# EAGLE design leds (EAGLE 9.6.2)
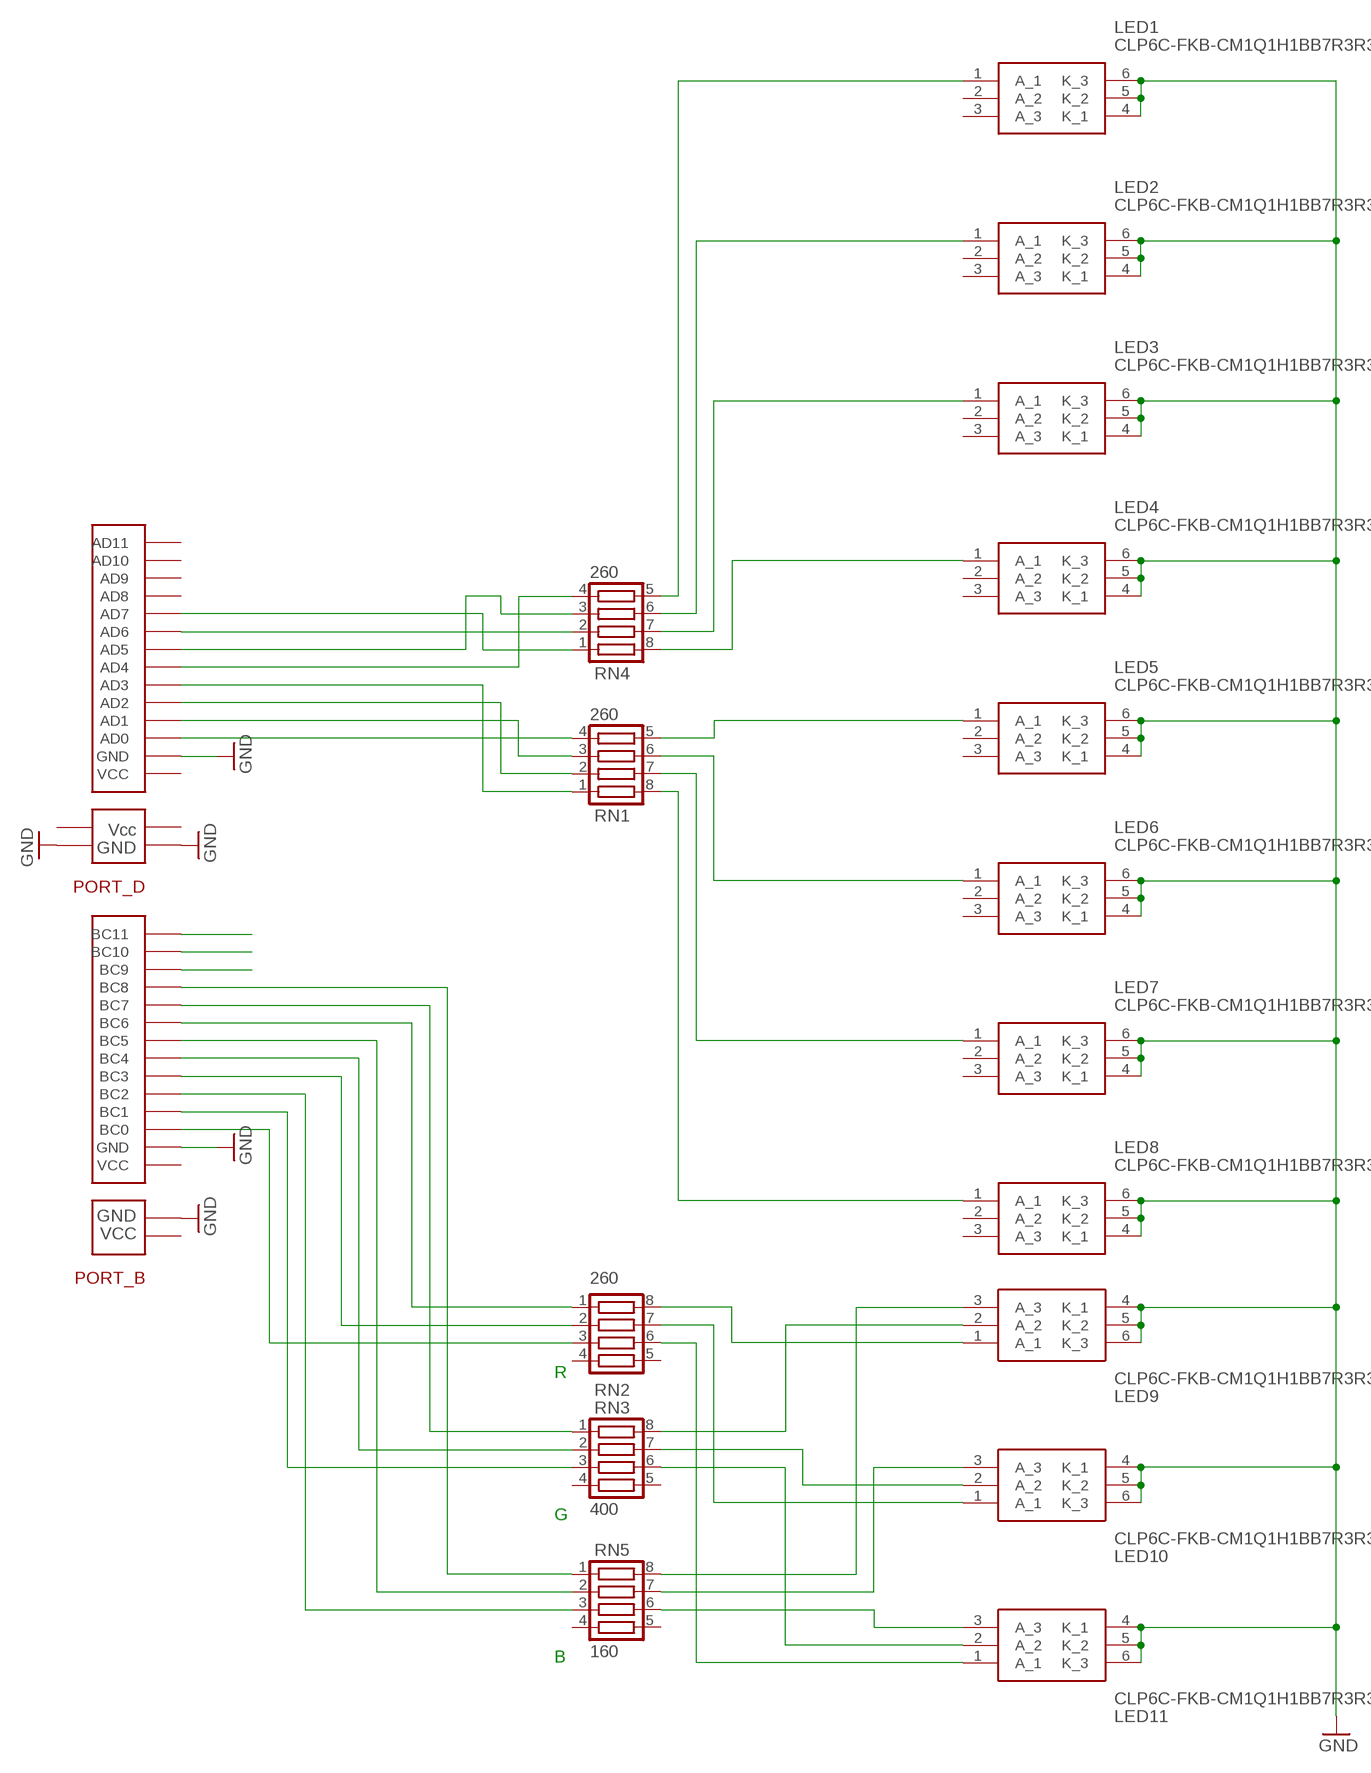
[diagram p0: schematic, sheet 1]

## Parts
LED1  CLP6C-FKB-CM1Q1H1BB7R3R3  [CLP6CFKBCM1Q1H1BB7R3R3]
LED2  CLP6C-FKB-CM1Q1H1BB7R3R3  [CLP6CFKBCM1Q1H1BB7R3R3]
LED3  CLP6C-FKB-CM1Q1H1BB7R3R3  [CLP6CFKBCM1Q1H1BB7R3R3]
LED4  CLP6C-FKB-CM1Q1H1BB7R3R3  [CLP6CFKBCM1Q1H1BB7R3R3]
LED5  CLP6C-FKB-CM1Q1H1BB7R3R3  [CLP6CFKBCM1Q1H1BB7R3R3]
LED6  CLP6C-FKB-CM1Q1H1BB7R3R3  [CLP6CFKBCM1Q1H1BB7R3R3]
LED7  CLP6C-FKB-CM1Q1H1BB7R3R3  [CLP6CFKBCM1Q1H1BB7R3R3]
LED8  CLP6C-FKB-CM1Q1H1BB7R3R3  [CLP6CFKBCM1Q1H1BB7R3R3]
LED9  CLP6C-FKB-CM1Q1H1BB7R3R3  [CLP6CFKBCM1Q1H1BB7R3R3]
LED10  CLP6C-FKB-CM1Q1H1BB7R3R3  [CLP6CFKBCM1Q1H1BB7R3R3]
LED11  CLP6C-FKB-CM1Q1H1BB7R3R3  [CLP6CFKBCM1Q1H1BB7R3R3]
PORT_B  PATICE_CERVENA  [PATICE_CERVENA]
PORT_D  PATICE_ZELENA  [PATICE_ZELENA]
RN1  260  CTS742C083  [CTS742C083]
RN2  260  CTS742C083  [CTS742C083]
RN3  400  CTS742C083  [CTS742C083]
RN4  260  CTS742C083  [CTS742C083]
RN5  160  CTS742C083  [CTS742C083]

## Nets
GND: LED1.4(K_1) LED1.5(K_2) LED1.6(K_3) LED2.4(K_1) LED2.5(K_2) LED2.6(K_3) LED3.4(K_1) LED3.5(K_2) LED3.6(K_3) LED4.4(K_1) LED4.5(K_2) LED4.6(K_3) LED5.4(K_1) LED5.5(K_2) LED5.6(K_3) LED6.4(K_1) LED6.5(K_2) LED6.6(K_3) LED7.4(K_1) LED7.5(K_2) LED7.6(K_3) LED8.4(K_1) LED8.5(K_2) LED8.6(K_3) LED9.4(K_1) LED9.5(K_2) LED9.6(K_3) LED10.4(K_1) LED10.5(K_2) LED10.6(K_3) LED11.4(K_1) LED11.5(K_2) LED11.6(K_3) PORT_B.GND PORT_B.GND/(GND) PORT_D.GND PORT_D.GND/(GND) PORT_D.GND//(GND)
N$1: LED1.1(A_1) RN4.5
N$2: LED2.1(A_1) RN4.6
N$3: LED3.1(A_1) RN4.7
N$4: LED4.1(A_1) RN4.8
N$5: PORT_B.CB3(BC3) RN2.2
N$6: PORT_B.CB0(BC0) RN2.3
N$7: LED7.1(A_1) RN1.7
N$8: LED9.2(A_2) RN3.8
N$9: LED8.1(A_1) RN1.8
N$10: PORT_D.AD0 RN1.4
N$12: PORT_B.CB6(BC6) RN2.1
N$13: PORT_B.CB9(BC9)
N$14: PORT_B.CB10(BC10)
N$15: PORT_B.CB11(BC11)
N$16: PORT_D.AD1 RN1.3
N$18: PORT_B.CB2(BC2) RN5.3
N$19: PORT_D.AD2 RN1.2
N$20: PORT_D.AD3 RN1.1
N$21: PORT_D.AD7 RN4.1
N$22: PORT_D.AD6 RN4.2
N$23: PORT_D.AD5 RN4.3
N$24: PORT_D.AD4 RN4.4
N$25: LED5.1(A_1) RN1.5
N$26: PORT_B.CB1(BC1) RN3.3
N$30: PORT_B.CB7(BC7) RN3.1
N$31: LED6.1(A_1) RN1.6
N$33: PORT_B.CB8(BC8) RN5.1
N$34: PORT_B.CB5(BC5) RN5.2
N$35: PORT_B.CB4(BC4) RN3.2
N$36: LED9.3(A_3) RN5.8
N$37: LED10.3(A_3) RN5.7
N$38: LED11.3(A_3) RN5.6
N$40: LED9.1(A_1) RN2.8
N$41: LED10.1(A_1) RN2.7
N$42: LED11.1(A_1) RN2.6
N$43: LED11.2(A_2) RN3.6
N$45: LED10.2(A_2) RN3.7
Unconnected: LED1.2(A_2) LED1.3(A_3) LED2.2(A_2) LED2.3(A_3) LED3.2(A_2) LED3.3(A_3) LED4.2(A_2) LED4.3(A_3) LED5.2(A_2) LED5.3(A_3) LED6.2(A_2) LED6.3(A_3) LED7.2(A_2) LED7.3(A_3) LED8.2(A_2) LED8.3(A_3) PORT_B.VCC PORT_B.VCC/(VCC) PORT_D.AD8 PORT_D.AD9 PORT_D.AD10 PORT_D.AD11 PORT_D.VCC PORT_D.VCC/(VCC) PORT_D.VCC//(VCC) RN2.4 RN2.5 RN3.4 RN3.5 RN5.4 RN5.5

## Notes on the sheet
- R
- G
- B

## Library data of the parts
LED1-LED11 = CLP6C-FKB-CM1Q1H1BB7R3R3:CLP6C-FKB-CM1Q1H1BB7R3R3: Cree,LED,CLP6C-FKB-CM1Q1H1BB7R3R3 Cree CLP6C-FKB-CM1Q1H1BB7R3R3, CLP6 Series Green LED, 540 nm, PLCC 6, Round Lens SMD Package Source: Datasheet <http://docs-emea.rs-online.com/webdocs/0cdd/0900766b80cddec4.pdf>; DESCRIPTION: Cree,LED,CLP6C-FKB-CM1Q1H1BB7R3R3 Cree CLP6C-FKB-CM1Q1H1BB7R3R3, CLP6 Series Green LED, 540 nm, PLCC 6, Round Lens SMD Package; HEIGHT: 2.6mm; MANUFACTURER_NAME: Cree, Inc.; MANUFACTURER_PART_NUMBER: CLP6C-FKB-CM1Q1H1BB7R3R3; MOUSER_PART_NUMBER: 941-P6CFKBCM1Q1H17R3; MOUSER_PRICE-STOCK: https://www.mouser.com/Search/Refine.aspx?Keyword=941-P6CFKBCM1Q1H17R3; RS_PART_NUMBER: 8106939P; RS_PRICE-STOCK: http://uk.rs-online.com/web/p/products/8106939P
PORT_B = patice_kit:PATICE_CERVENA
PORT_D = patice_kit:PATICE_ZELENA
RN1 RN2 RN4 = resistor-net:CTS742C083: Chip Resistor Array 4 Single Resistor Source: http://www.ctscorp.com/components/Datasheets/CTSChipArrayDs.pdf; FARNELL: 2908182; OC_FARNELL: unknown; OC_NEWARK: unknown
RN3 = resistor-net:CTS742C083: Chip Resistor Array 4 Single Resistor Source: http://www.ctscorp.com/components/Datasheets/CTSChipArrayDs.pdf; FARNELL: 2787792; OC_FARNELL: unknown; OC_NEWARK: unknown
RN5 = resistor-net:CTS742C083: Chip Resistor Array 4 Single Resistor Source: http://www.ctscorp.com/components/Datasheets/CTSChipArrayDs.pdf; FARNELL: 2321721; OC_FARNELL: unknown; OC_NEWARK: unknown

## Board
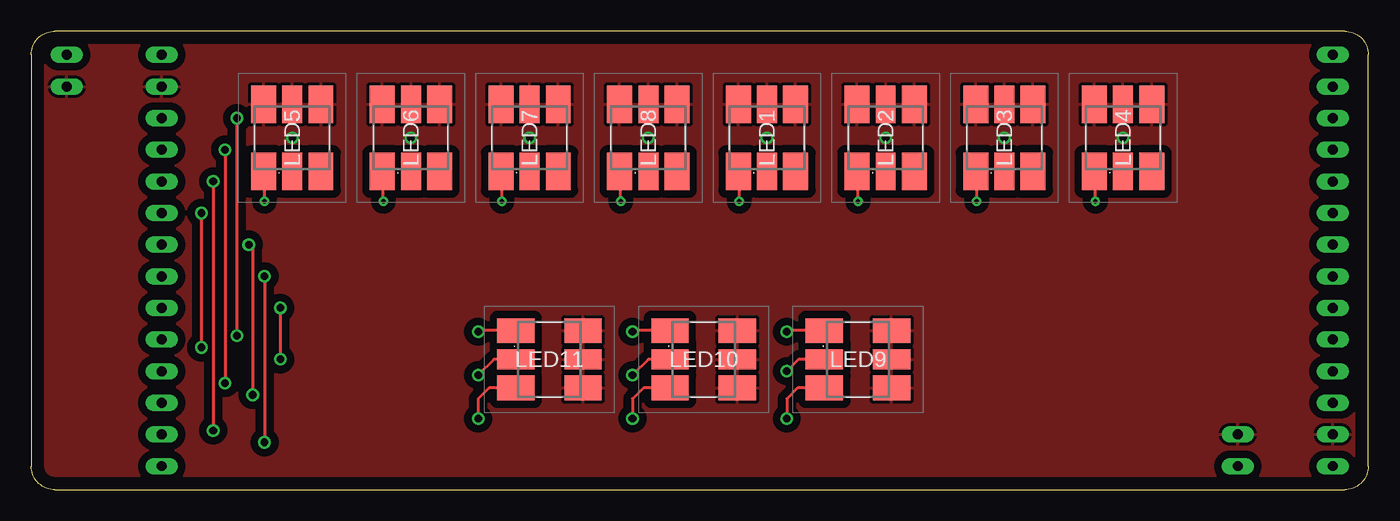
[diagram p1: board, top side]
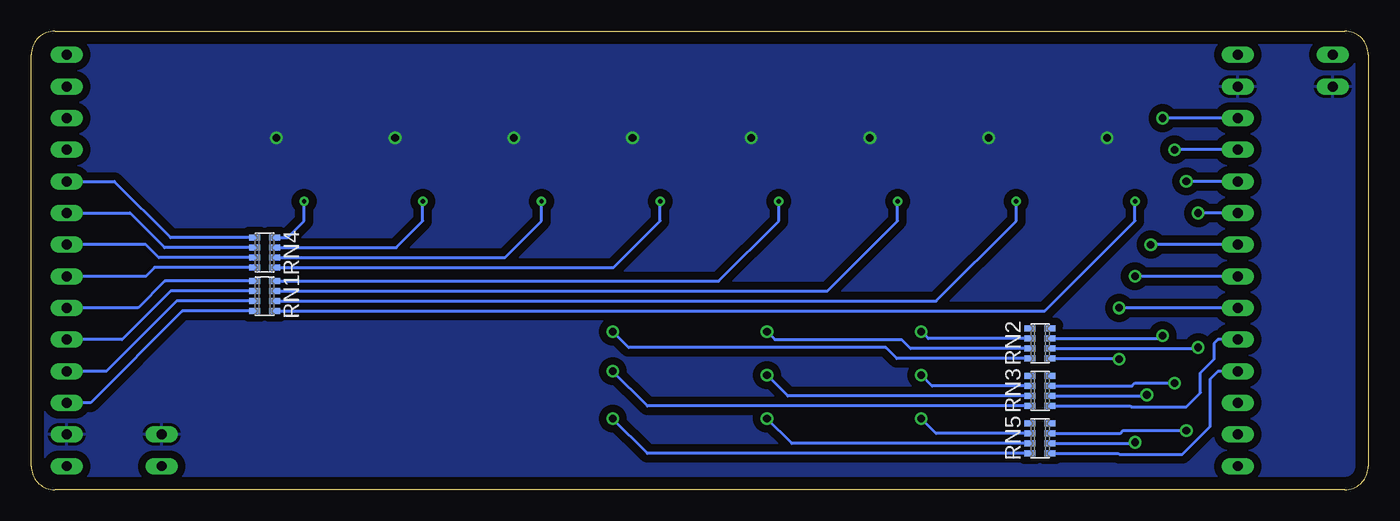
[diagram p2: board, bottom side, seen from below]

Size 107.31 x 36.83 mm. Coordinates in mm from the lower left corner, seen from the top.
Outline: 1.9,0 105.41,0 arc90 107.31,1.91 107.31,34.92 arc90 105.41,36.83 1.9,36.83 arc90 0,34.92 0,1.91 arc90 1.9,0
Copper layers (1*16): Top 0.035mm / dielectric 1.5mm / Bottom 0.035mm
Design rules "default": minimum track width 10mil, minimum drill 24mil, track to track 8mil, track to pad 8mil, pad to pad 8mil, via to via 8mil, smd to smd 8mil, copper to edge 40mil, drill to drill 8mil, minimum pad ring 10mil, minimum via ring 8mil, stop-mask expansion 4mil, vias tented up to drill 0mil, thermal gap 10mil

### Footprints (pad centres in the part's own frame; a part is rotated, then mirrored left to right if it is on the bottom)
CLP6CFKBCM1Q1H1BB7R3R3 = smd 3 x 2: 1 -2.7,2.3; 3 -2.7,-2.3; 4 2.7,-2.3; 6 2.7,2.3 | smd 3 x 1.6: 2 -2.7,0; 5 2.7,0
PATICE_CERVENA = drill 0.8 long: CB0 0,-5.08; CB1 0,-7.62; CB2 0,-10.16; CB3 0,-12.7; CB4 0,-15.24; CB5 0,-17.78; CB6 0,-20.32; CB7 0,-22.86; CB8 0,-25.4; CB9 0,-27.94; CB10 0,-30.48; CB11 0,-33.02; GND 0,-2.54; GND/ 86.36,-30.48; VCC 0,0; VCC/ 86.36,-33.02
PATICE_ZELENA = drill 0.8 long: AD0 0,-5.08; AD1 0,-7.62; AD2 0,-10.16; AD3 0,-12.7; AD4 0,-15.24; AD5 0,-17.78; AD6 0,-20.32; AD7 0,-22.86; AD8 0,-25.4; AD9 0,-27.94; AD10 0,-30.48; AD11 0,-33.02; GND 0,-2.54; GND/ 93.98,-30.48; GND// 101.6,-30.48; VCC 0,0; VCC/ 93.98,-33.02; VCC// 101.6,-33.02
CTS742C083 = smd 0.5 x 0.9: 1 -1.2,-0.8; 2 -0.4,-0.8; 3 0.4,-0.8; 4 1.2,-0.8; 5 1.2,0.8; 6 0.4,0.8; 7 -0.4,0.8; 8 -1.2,0.8

### Placement (x,y rotation side)
LED1  59.05,28.26 90 top
LED2  68.58,28.26 90 top
LED3  78.11,28.26 90 top
LED4  87.63,28.26 90 top
LED5  20.95,28.26 90 top
LED6  30.48,28.26 90 top
LED7  40.01,28.26 90 top
LED8  49.53,28.26 90 top
LED9  66.36,10.48 0 top
LED10  53.98,10.48 0 top
LED11  41.59,10.48 0 top
PORT_B  10.48,34.92 0 top
PORT_D  104.46,1.91 180 top
RN1  88.58,15.56 270 bottom
RN2  26.35,11.75 90 bottom
RN3  26.35,7.94 90 bottom
RN4  88.58,19.05 270 bottom
RN5  26.35,4.13 90 bottom

### Tracks (layer width: path | path; a pad name or v marks a point on that pad's centre or on a via)
GND  (via drill 0.61)
  other vias: 20.95,28.26 30.48,28.26 40.01,28.26 49.53,28.26 59.05,28.26 68.58,28.26 78.11,28.26 87.63,28.26
  pour Top (isolate 0.61): -0.95,38.1 108.59,38.1 108.59,-0.64 -0.95,-0.64
  pour Bottom (isolate 0.61): -1.91,39.69 109.86,39.69 109.86,-1.59 -1.91,-1.59
N$1  (via drill 0.35)
  Top 0.254: v56.83,23.18 56.83,25.48 LED1.1
  Bottom 0.254: RN4.5 60.57,17.85 56.83,21.59 v56.83,23.18
N$2  (via drill 0.35)
  Top 0.254: v66.36,23.18 66.36,25.48 LED2.1
  Bottom 0.254: RN4.6 69.3,18.65 66.36,21.59 v66.36,23.18
N$3  (via drill 0.35)
  Top 0.254: v75.88,23.18 75.88,25.48 LED3.1
  Bottom 0.254: RN4.7 78.02,19.45 75.88,21.59 v75.88,23.18
N$4  (via drill 0.35)
  Top 0.254: v85.41,23.18 85.41,25.48 LED4.1
  Bottom 0.254: RN4.8 86.75,20.25 85.41,21.59 v85.41,23.18
N$5  (via drill 0.61)
  Top 0.254: v13.65,22.23 v13.65,11.43
  Bottom 0.254: PORT_B.CB3 v13.65,22.23 | RN2.2 13.73,11.35 v13.65,11.43
N$6  (via drill 0.61)
  Top 0.254: v16.51,29.85 v16.51,12.38
  Bottom 0.254: PORT_B.CB0 v16.51,29.85 | RN2.3 16.74,12.15 v16.51,12.38
N$7  (via drill 0.35)
  Top 0.254: v37.78,23.18 37.78,25.48 LED7.1
  Bottom 0.254: RN1.7 43.41,15.96 37.78,21.59 v37.78,23.18
N$8  (via drill 0.61)
  Top 0.254: LED9.2 61.59,10.48 v60.64,9.53
  Bottom 0.254: RN3.8 57.86,6.74 v60.64,9.53
N$9  (via drill 0.35)
  Top 0.254: v47.31,23.18 47.31,25.48 LED8.1
  Bottom 0.254: RN1.8 52.14,16.76 47.31,21.59 v47.31,23.18
N$10
  Bottom 0.254: RN1.4 95.18,14.36 102.55,6.98 PORT_D.AD0
N$12  (via drill 0.61)
  Top 0.254: v20,14.61 v20,10.48
  Bottom 0.254: PORT_B.CB6 v20,14.61 | RN2.1 20.07,10.55 v20,10.48
N$16
  Bottom 0.254: RN1.3 95.65,15.16 101.28,9.53 PORT_D.AD1
N$18  (via drill 0.61)
  Top 0.254: v14.61,24.77 v14.61,4.76
  Bottom 0.254: PORT_B.CB2 v14.61,24.77 | v14.61,4.76 19.69,4.76 19.92,4.53 RN5.3
N$19
  Bottom 0.254: RN1.2 96.12,15.96 100.01,12.06 PORT_D.AD2
N$20
  Bottom 0.254: RN1.1 96.59,16.76 98.74,14.61 PORT_D.AD3
N$21
  Bottom 0.254: PORT_D.AD7 100.65,24.77 96.13,20.25 RN4.1
N$22
  Bottom 0.254: RN4.2 96.6,19.45 99.38,22.23 PORT_D.AD6
N$23
  Bottom 0.254: RN4.3 97.07,18.65 98.11,19.69 PORT_D.AD5
N$24
  Bottom 0.254: RN4.4 97.4,17.85 98.11,17.15 PORT_D.AD4
N$25  (via drill 0.35)
  Top 0.254: v18.73,23.18 18.73,25.48 LED5.1
  Bottom 0.254: RN1.5 25.97,14.36 18.73,21.59 v18.73,23.18
N$26  (via drill 0.61)
  Top 0.254: v15.56,27.31 v15.56,8.57
  Bottom 0.254: PORT_B.CB1 v15.56,27.31 | RN3.3 18.97,8.34 18.73,8.57 v15.56,8.57
N$30
  Bottom 0.254: PORT_B.CB7 12.06,12.06 12.38,11.75 12.38,10.49 13.47,9.4 13.47,7.8 14.61,6.67 19.05,6.67 19.12,6.74 RN3.1
N$31  (via drill 0.35)
  Top 0.254: v28.26,23.18 28.26,25.48 LED6.1
  Bottom 0.254: RN1.6 34.69,15.16 28.26,21.59 v28.26,23.18
N$33
  Bottom 0.254: PORT_B.CB8 12.06,9.53 12.7,8.89 12.7,5.08 14.92,2.86 20,2.86 20.07,2.93 RN5.1
N$34  (via drill 0.61)
  Top 0.254: v18.73,17.15 v18.73,3.81
  Bottom 0.254: PORT_B.CB5 v18.73,17.15 | RN5.2 18.81,3.73 v18.73,3.81
N$35  (via drill 0.61)
  Top 0.254: v17.46,19.69 17.78,19.37 v17.78,7.62
  Bottom 0.254: PORT_B.CB4 v17.46,19.69 | RN3.2 17.86,7.54 v17.78,7.62
N$36  (via drill 0.61)
  Top 0.254: LED9.3 61.52,8.18 60.64,7.3 v60.64,5.71
  Bottom 0.254: RN5.8 57.86,2.93 v60.64,5.71
N$37  (via drill 0.61)
  Top 0.254: LED10.3 49.14,8.18 48.26,7.3 v48.26,5.71
  Bottom 0.254: RN5.7 46.27,3.73 v48.26,5.71
N$38  (via drill 0.61)
  Top 0.254: LED11.3 36.75,8.18 35.88,7.3 v35.88,5.71
  Bottom 0.254: RN5.6 34.69,4.53 v35.88,5.71
N$40  (via drill 0.61)
  Top 0.254: LED9.1 60.72,12.78 v60.64,12.7
  Bottom 0.254: RN2.8 37.85,10.55 38.73,11.43 59.37,11.43 v60.64,12.7
N$41  (via drill 0.61)
  Top 0.254: LED10.1 48.34,12.78 v48.26,12.7
  Bottom 0.254: RN2.7 36.75,11.35 37.47,12.06 47.62,12.06 v48.26,12.7
N$42  (via drill 0.61)
  Top 0.254: LED11.1 35.95,12.78 v35.88,12.7
  Bottom 0.254: RN2.6 35.33,12.15 v35.88,12.7
N$43  (via drill 0.61)
  Top 0.254: LED11.2 37.15,10.48 v35.88,9.21
  Bottom 0.254: RN3.6 35.01,8.34 v35.88,9.21
N$45  (via drill 0.61)
  Top 0.254: LED10.2 49.53,10.48 v48.26,9.21
  Bottom 0.254: RN3.7 46.59,7.54 v48.26,9.21

### Text on the board
Top: Potisk pouze ze strany TOP, vrstva 100!!
tStop: LED modul v4 2020 / david.seidl@vsb.cz / petr.olivka@vsb.cz
Popis: LED0 | LED7 | RGB0 | RGB1 | RGB2